# EAGLE design v0.1 (EAGLE 9.5.2)

## Sheet 1 of 2
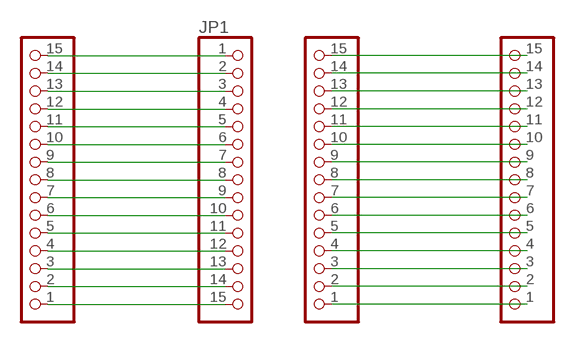
[diagram p0: schematic, sheet 1]

### Parts
JP1  PINHD-1X15-CASTELLATED  [1X15-CASTELL]
JP2  PINHD-1X15-CASTELLATED  [1X15-CASTELL]
JP3  PINHD-1X15-CASTELLATED  [1X15-CASTELL]
JP4  PINHD-1X15-CASTELLATED  [1X15-CASTELL]

### Nets
N$1: JP1.1 JP2.15
N$2: JP1.2 JP2.14
N$3: JP1.3 JP2.13
N$4: JP1.4 JP2.12
N$5: JP1.5 JP2.11
N$6: JP1.6 JP2.10
N$7: JP1.7 JP2.9
N$8: JP1.8 JP2.8
N$9: JP1.9 JP2.7
N$10: JP1.10 JP2.6
N$11: JP1.11 JP2.5
N$12: JP1.12 JP2.4
N$13: JP1.13 JP2.3
N$14: JP1.14 JP2.2
N$15: JP1.15 JP2.1
N$16: JP3.1 JP4.1
N$17: JP3.2 JP4.2
N$18: JP3.3 JP4.3
N$19: JP3.4 JP4.4
N$20: JP3.5 JP4.5
N$21: JP3.6 JP4.6
N$22: JP3.7 JP4.7
N$23: JP3.8 JP4.8
N$24: JP3.9 JP4.9
N$25: JP3.10 JP4.10
N$26: JP3.11 JP4.11
N$27: JP3.12 JP4.12
N$28: JP3.13 JP4.13
N$29: JP3.14 JP4.14
N$30: JP3.15 JP4.15

## Sheet 2 of 2

## Library data of the parts
JP1-JP4 = Arduino-connectors:PINHD-1X15: PIN HEADER

## Net classes
0 default: width 0.19 mm, drill 0.19 mm
1 usb: width 0.19 mm, drill 0.19 mm

## Board
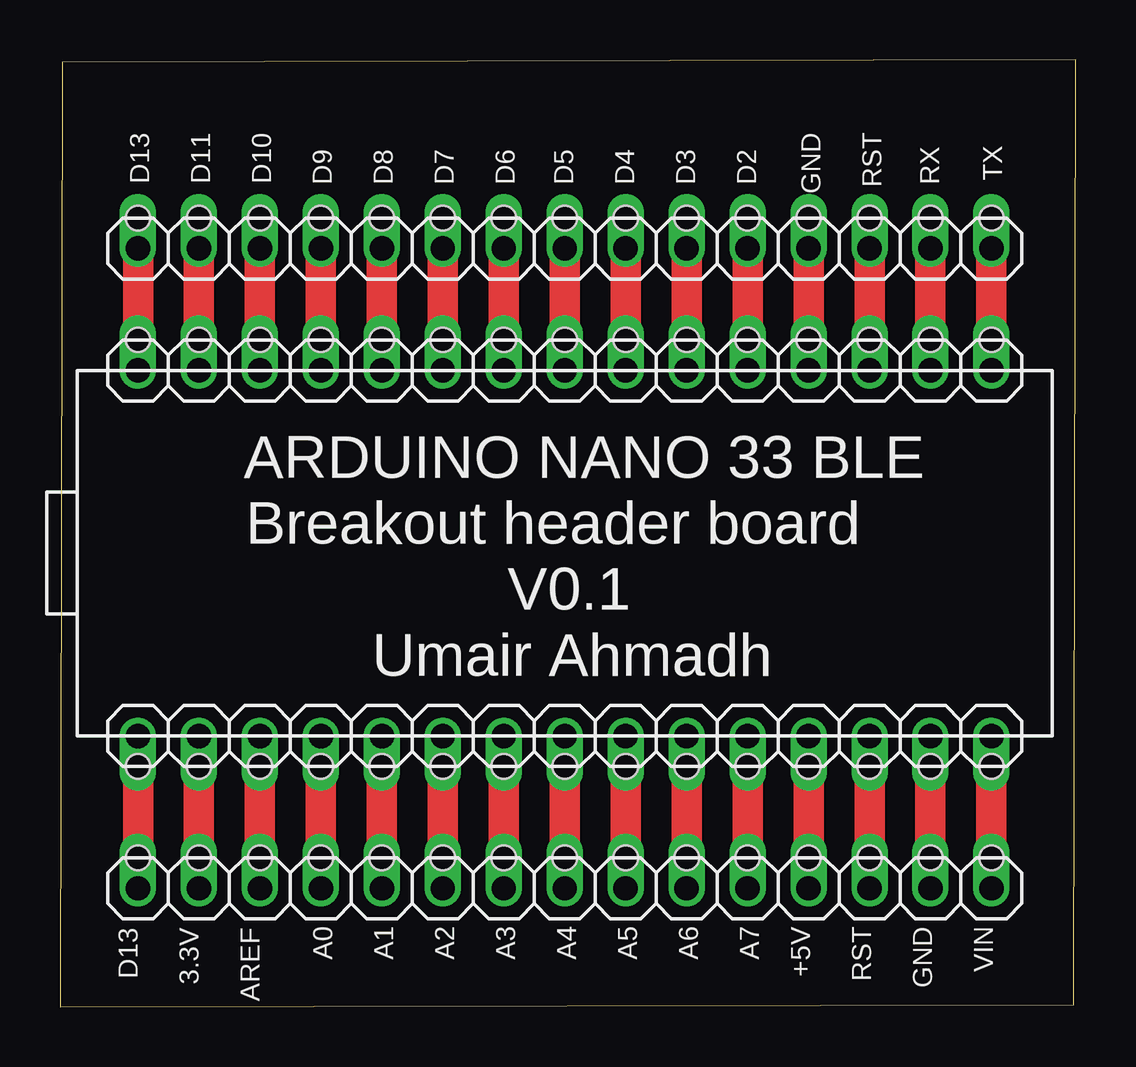
[diagram p1: board, top side]
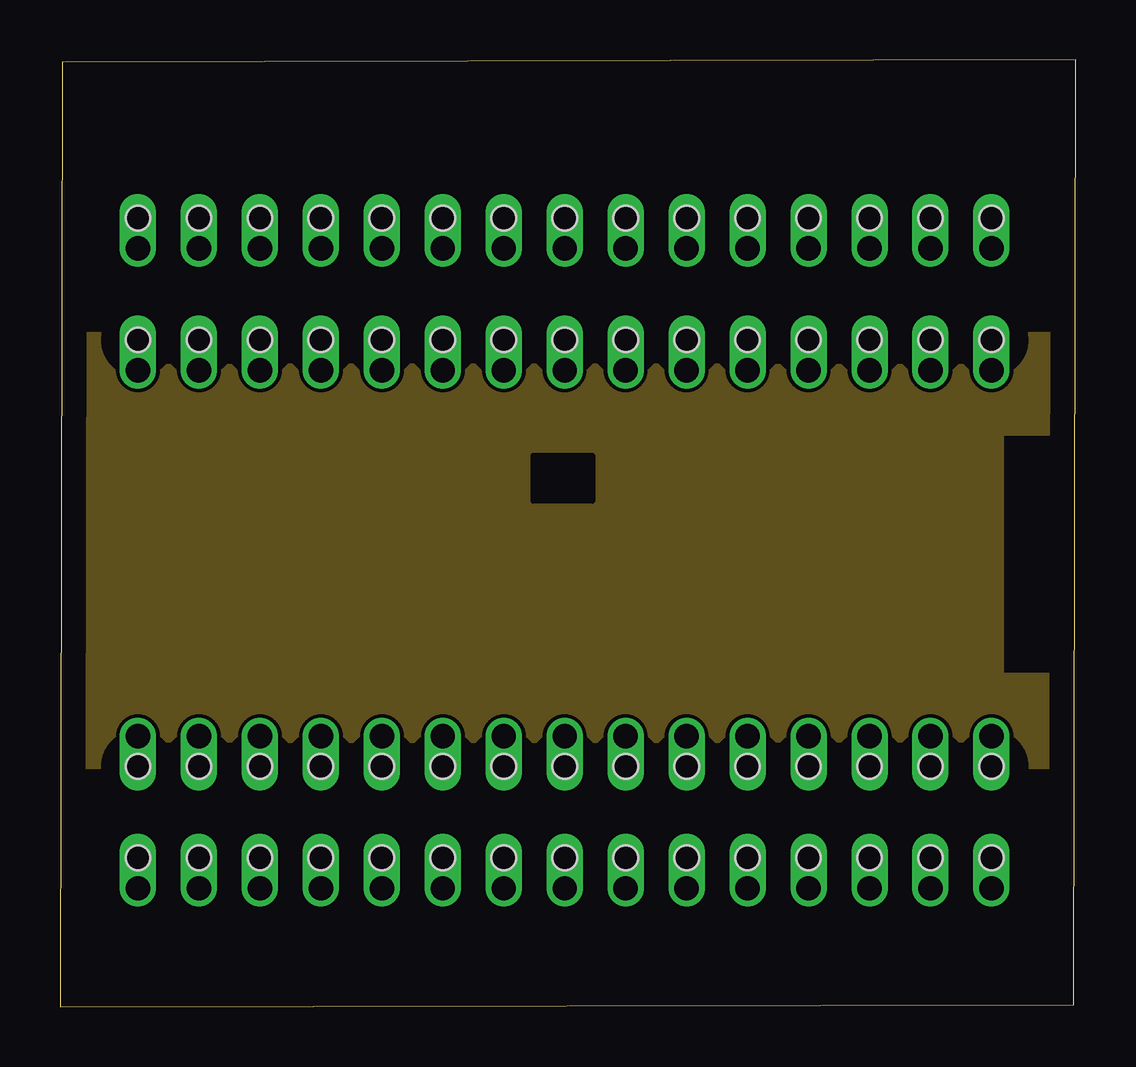
[diagram p2: board, inner layer Route2]
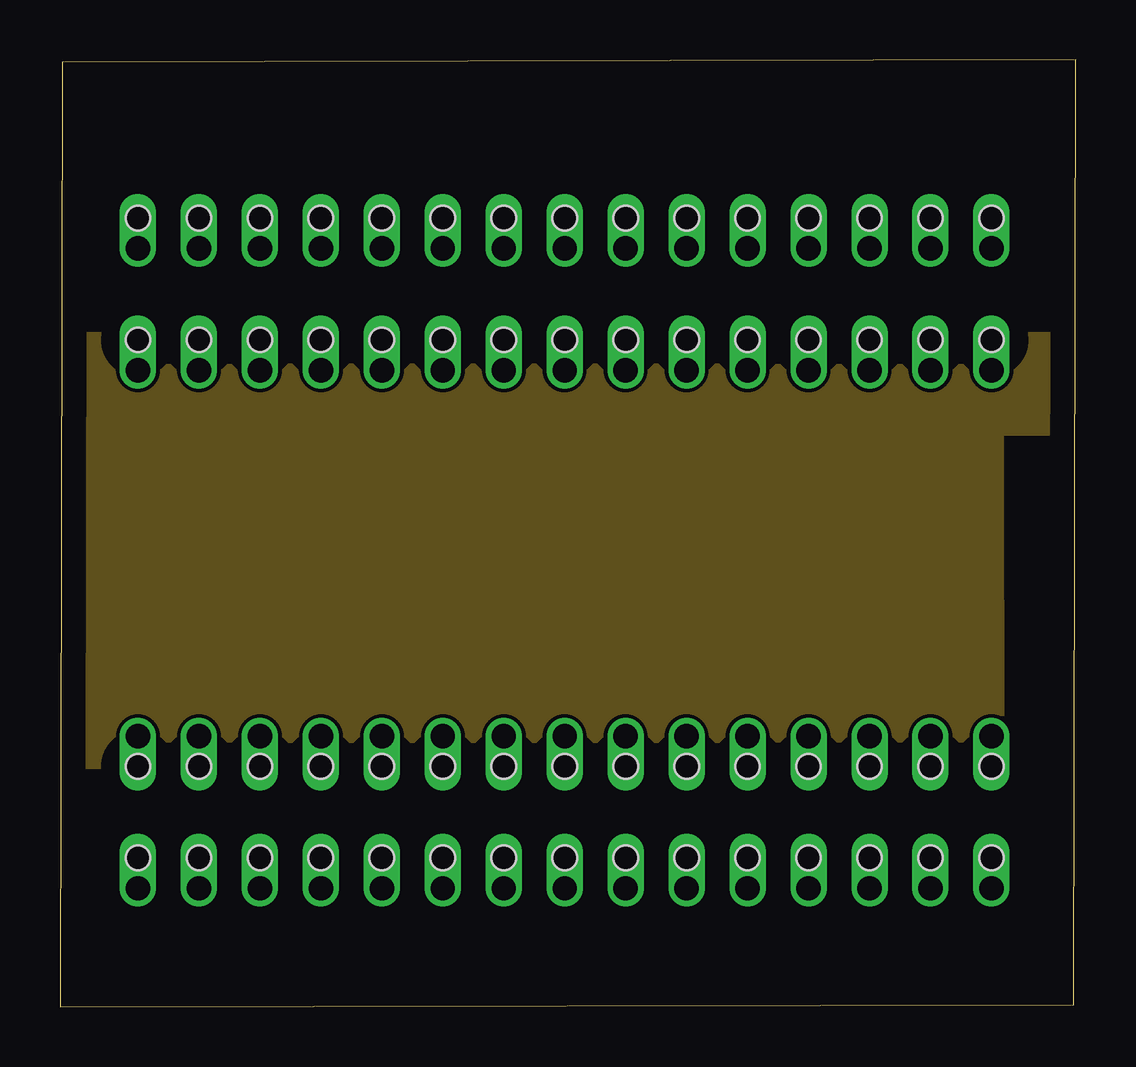
[diagram p3: board, inner layer Route15]

Size 42.33 x 39.47 mm. Coordinates in mm from the lower left corner, seen from the top.
Outline: 0,0 42.23,0.09 42.33,39.47 0.1,39.38 0,0
Copper layers (1*16): Top 0.035mm / dielectric 1.5mm / Bottom 0.035mm
Design rules "default": minimum track width 6mil, minimum drill 0.35mm, track to track 6mil, track to pad 6mil, pad to pad 6mil, via to via 6mil, smd to smd 6mil, copper to edge 40mil, drill to drill 6mil, minimum pad ring 10mil, minimum via ring 8mil, stop-mask expansion 4mil, vias tented up to drill 0mil, thermal gap 10mil

### Footprints (pad centres in the part's own frame; a part is rotated, then mirrored left to right if it is on the bottom)
1X15-CASTELL = drill 1.016 offset: 1 -17.78,0; 2 -15.24,0; 3 -12.7,0; 4 -10.16,0; 5 -7.62,0; 6 -5.08,0; 7 -2.54,0; 8 0,0; 9 2.54,0; 10 5.08,0; 11 7.62,0; 12 10.16,0; 13 12.7,0; 14 15.24,0; 15 17.78,0 | hole 1.016: 17.78,-1.27; 15.24,-1.27; 12.7,-1.27; 10.16,-1.27; 7.62,-1.27; 5.08,-1.27; 2.54,-1.27; 0,-1.27; -2.54,-1.27; -5.08,-1.27; -7.62,-1.27; -10.16,-1.27; -12.7,-1.27; -15.24,-1.27; -17.78,-1.27

### Placement (x,y rotation side)
JP1  21.03,11.29 0 top
JP2  21.03,4.94 180 top
JP3  21.03,31.61 180 top
JP4  21.03,26.53 180 top

### Tracks (layer width: path | path; a pad name or v marks a point on that pad's centre or on a via)
1
  cutout Route2: 19.72,23 22.19,23 22.19,21.07 19.72,21.07
+3V3
  pour Route2: -0.56,28.02 42.62,28.02 42.62,23.92 39.19,23.92 39.19,13.82 42.62,13.82 42.62,13.05 42.62,10.04 42.62,10.02 -0.56,10.02
GND
  pour Route15: -0.51,28.02 42.62,28.02 42.62,23.92 39.19,23.92 39.22,10.02 -0.56,10.02 -0.56,27.82
N$1
  Top 1.27: JP2.15 JP1.1
N$2
  Top 1.27: JP1.2 JP2.14
N$3
  Top 1.27: JP2.13 JP1.3
N$4
  Top 1.27: JP1.4 JP2.12
N$5
  Top 1.27: JP2.11 JP1.5
N$6
  Top 1.27: JP2.10 JP1.6
N$7
  Top 1.27: JP1.7 JP2.9
N$8
  Top 1.27: JP1.8 JP2.8
N$9
  Top 1.27: JP2.7 JP1.9
N$10
  Top 1.27: JP1.10 JP2.6
N$11
  Top 1.27: JP2.5 JP1.11
N$12
  Top 1.27: JP1.12 JP2.4
N$13
  Top 1.27: JP1.13 JP2.3
N$14
  Top 1.27: JP1.14 JP2.2
N$15
  Top 1.27: JP2.1 JP1.15
N$16
  Top 1.27: JP3.1 JP4.1
N$17
  Top 1.27: JP4.2 JP3.2
N$18
  Top 1.27: JP3.3 JP4.3
N$19
  Top 1.27: JP4.4 JP3.4
N$20
  Top 1.27: JP3.5 JP4.5
N$21
  Top 1.27: JP4.6 JP3.6
N$22
  Top 1.27: JP3.7 JP4.7
N$23
  Top 1.27: JP4.8 JP3.8
N$24
  Top 1.27: JP4.9 JP3.9
N$25
  Top 1.27: JP3.10 JP4.10
N$26
  Top 1.27: JP3.11 JP4.11
N$27
  Top 1.27: JP4.12 JP3.12
N$28
  Top 1.27: JP3.13 JP4.13
N$29
  Top 1.27: JP4.14 JP3.14
N$30
  Top 1.27: JP3.15 JP4.15

### Text on the board
tPlace: D13 | D11 | D10 | GND | RST | D9 | D8 | D7 | D6 | D5 | D4 | D3 | D2 | RX | TX | ARDUINO NANO 33 BLE | Breakout header board | V0.1 | Umair Ahmadh | D13 | 3.3V | AREF | A0 | A1 | A2 | A3 | A4 | A5 | A6 | A7 | +5V | RST | GND | VIN